# EAGLE schematic col_driver (EAGLE 6.4)
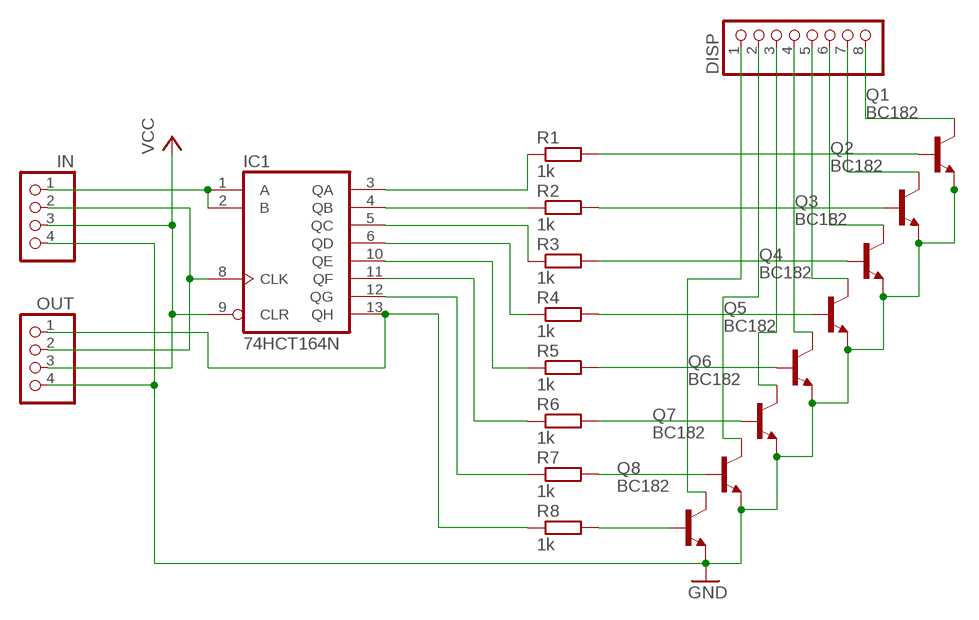
[diagram p0: schematic, sheet 1]

## Parts
DISP  PINHD-1X8  [1X08]
IC1  74HCT164N  [DIL14]
IN  PINHD-1X4  [1X04]
OUT  PINHD-1X4  [1X04]
Q1  BC182  BC237  [TO92]
Q2  BC182  BC237  [TO92]
Q3  BC182  BC237  [TO92]
Q4  BC182  BC237  [TO92]
Q5  BC182  BC237  [TO92]
Q6  BC182  BC237  [TO92]
Q7  BC182  BC237  [TO92]
Q8  BC182  BC237  [TO92]
R1  1k  R-EU_0207/10  [0207/10]
R2  1k  R-EU_0207/10  [0207/10]
R3  1k  R-EU_0207/10  [0207/10]
R4  1k  R-EU_0207/10  [0207/10]
R5  1k  R-EU_0207/10  [0207/10]
R6  1k  R-EU_0207/10  [0207/10]
R7  1k  R-EU_0207/10  [0207/10]
R8  1k  R-EU_0207/10  [0207/10]

## Nets
GND: IN.4 OUT.4 Q1.1(E) Q2.1(E) Q3.1(E) Q4.1(E) Q5.1(E) Q6.1(E) Q7.1(E) Q8.1(E)
N$1: IC1.1(A) IC1.2(B) IN.1
N$2: IC1.8(CLK) IN.2 OUT.2
N$4: IC1.4(QB) R2.1
N$5: IC1.5(QC) R3.1
N$6: IC1.13(QH) OUT.1 R8.1
N$7: Q1.2(B) R1.2
N$8: Q2.2(B) R2.2
N$9: Q3.2(B) R3.2
N$10: Q4.2(B) R4.2
N$11: Q5.2(B) R5.2
N$12: Q6.2(B) R6.2
N$13: Q7.2(B) R7.2
N$14: Q8.2(B) R8.2
N$15: IC1.3(QA) R1.1
N$16: IC1.6(QD) R4.1
N$17: IC1.10(QE) R5.1
N$18: IC1.11(QF) R6.1
N$19: IC1.12(QG) R7.1
N$21: DISP.4 Q5.3(C)
N$22: DISP.5 Q4.3(C)
N$23: DISP.6 Q3.3(C)
N$24: DISP.7 Q2.3(C)
N$25: DISP.8 Q1.3(C)
N$26: DISP.3 Q6.3(C)
N$27: DISP.2 Q7.3(C)
N$28: DISP.1 Q8.3(C)
VCC: IC1.9(CLR) IN.3 OUT.3

## Power pins joined to a net without a drawn wire
GND: IC1.7(GND)
VCC: IC1.14(VCC)

## Library data of the parts
DISP = pinhead:PINHD-1X8: PIN HEADER
IC1 = 74xx-eu:74*164: 8-bit parallel out SHIFT REGISTER
IN OUT = pinhead:PINHD-1X4: PIN HEADER
Q1-Q8 = transistor-npn:BC237: NPN Transistor
R1-R8 = resistor:R-EU_: RESISTOR, European symbol